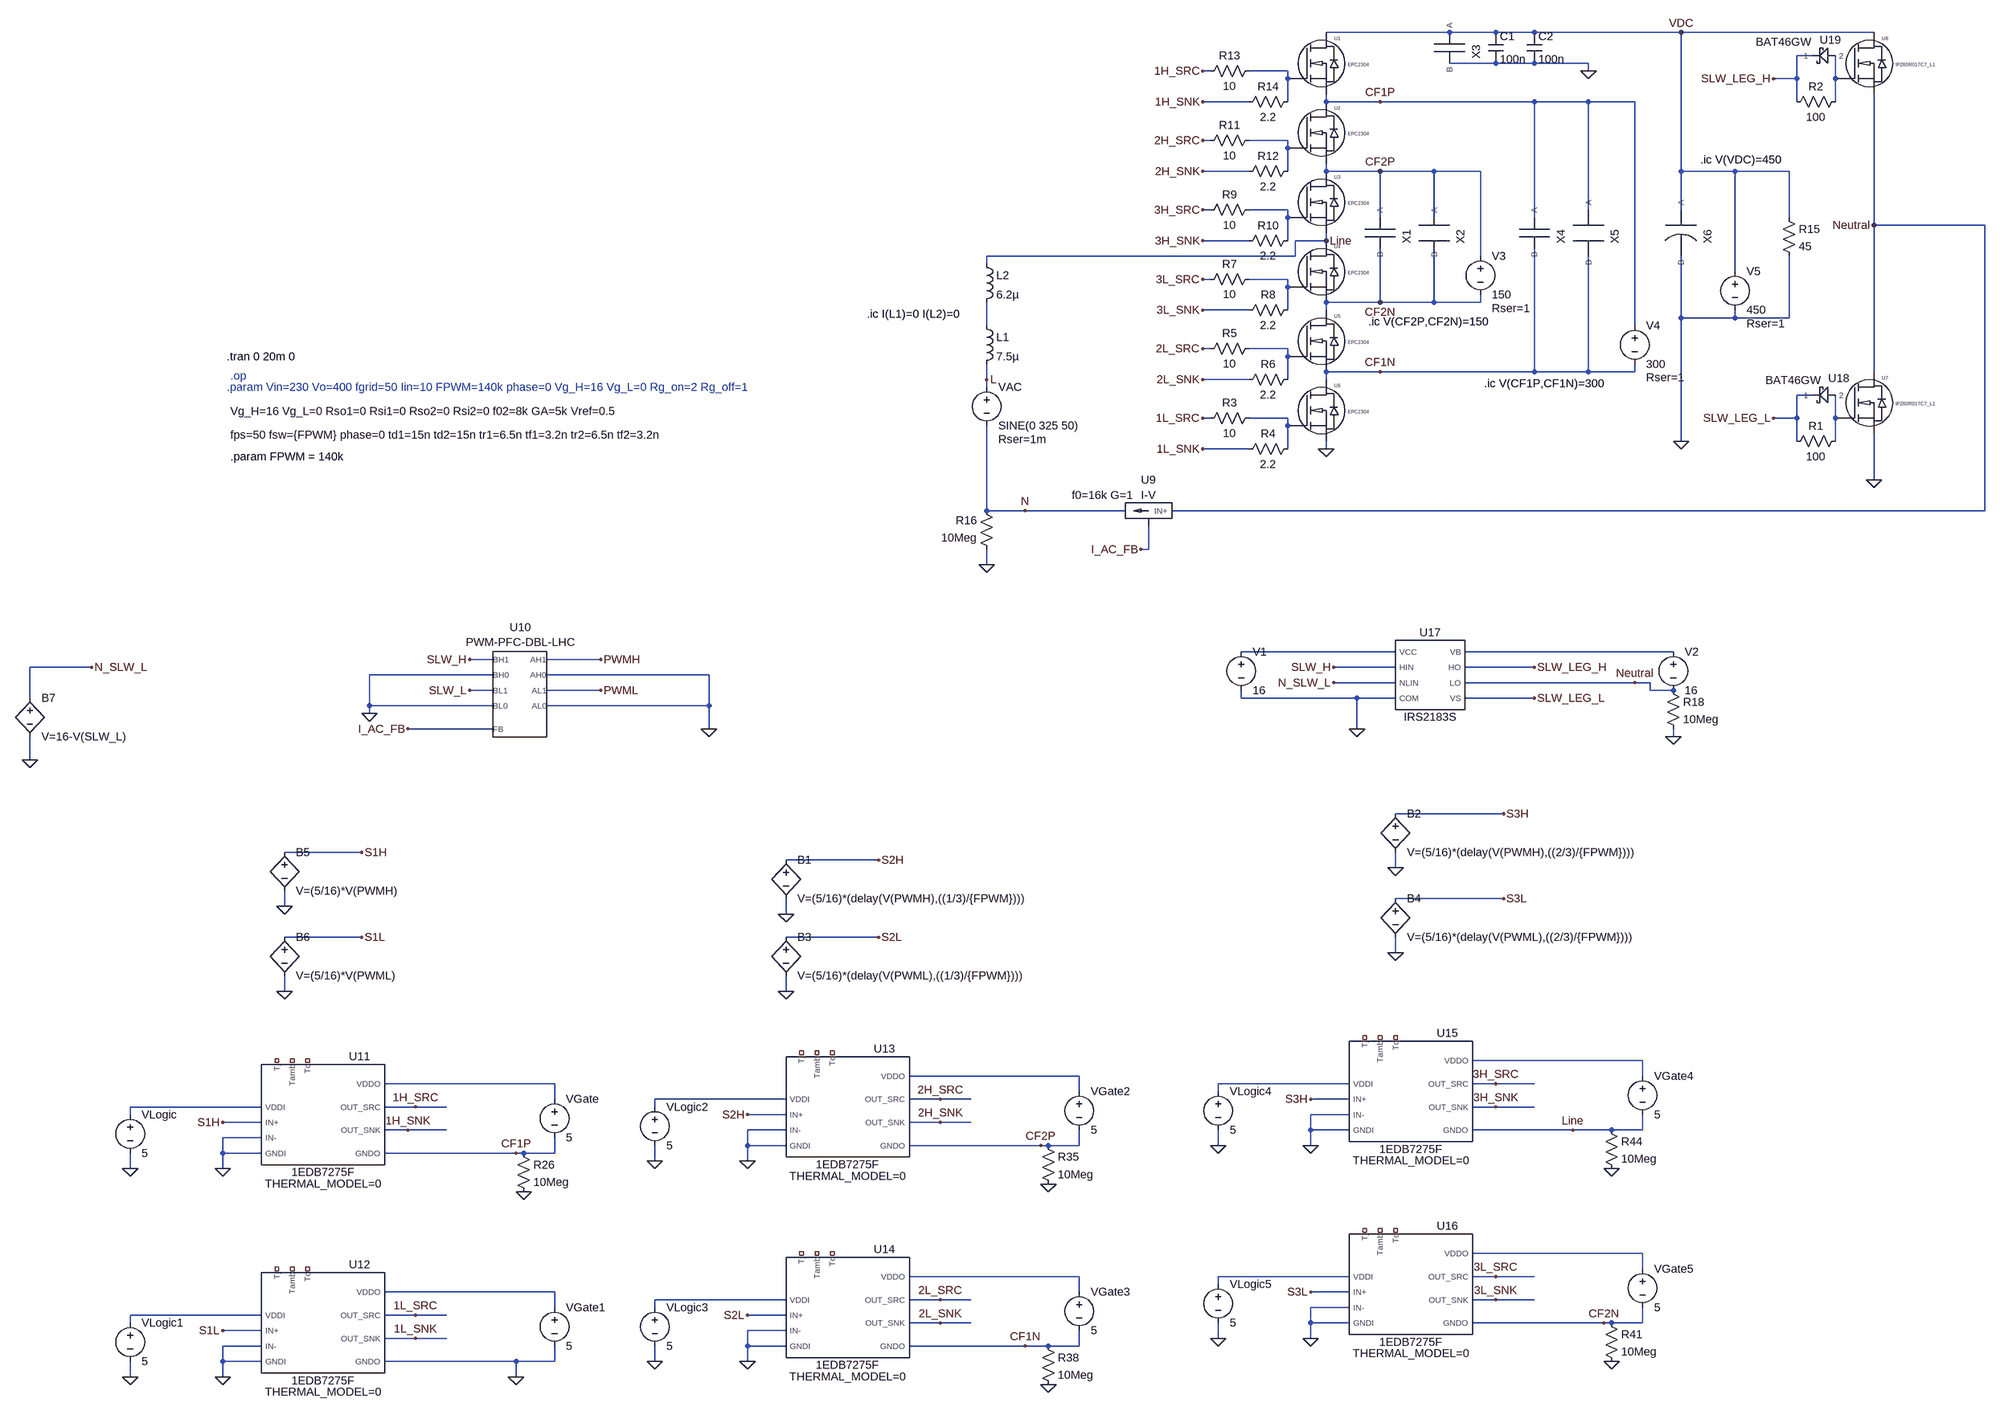
[diagram p0: schematic PFC.asc]
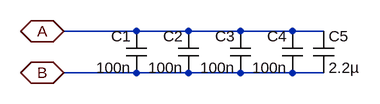
[diagram p1: sub-circuit hf_decoup.asc]
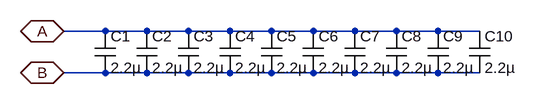
[diagram p2: sub-circuit fl2.asc]
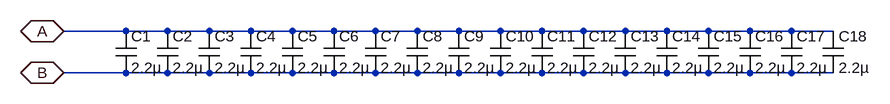
[diagram p3: sub-circuit fl1.asc]
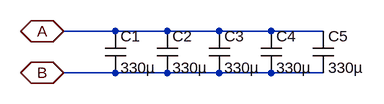
[diagram p4: sub-circuit bulk_cap.asc]
PFC.asc, the LTspice schematic file:
Version 4.1
SHEET 1 4276 2968
WIRE 352 0 96 0
WIRE 448 0 352 0
WIRE 528 0 448 0
WIRE 832 0 528 0
WIRE 1232 0 832 0
WIRE 1104 48 1072 48
WIRE 448 64 352 64
WIRE 528 64 448 64
WIRE 640 64 528 64
WIRE -144 80 -160 80
WIRE 16 80 -64 80
WIRE 640 80 640 64
WIRE 16 96 16 80
WIRE 1072 96 1072 48
WIRE 1072 96 1024 96
WIRE 1152 96 1152 48
WIRE -64 144 -160 144
WIRE 16 144 16 96
WIRE 96 144 96 128
WIRE 208 144 96 144
WIRE 528 144 208 144
WIRE 640 144 528 144
WIRE 736 144 640 144
WIRE 1072 144 1072 96
WIRE 1152 144 1152 96
WIRE -144 224 -160 224
WIRE 16 224 -64 224
WIRE 16 240 16 224
WIRE -64 288 -160 288
WIRE 16 288 16 240
WIRE 96 288 96 272
WIRE 208 288 96 288
WIRE 320 288 208 288
WIRE 416 288 320 288
WIRE 832 288 832 0
WIRE 944 288 832 288
WIRE 1056 288 944 288
WIRE -144 368 -160 368
WIRE 16 368 -64 368
WIRE 640 368 640 144
WIRE 832 368 832 288
WIRE 16 384 16 368
WIRE 208 384 208 288
WIRE 320 384 320 288
WIRE 528 384 528 144
WIRE 1056 384 1056 288
WIRE 1232 400 1232 128
WIRE 1792 400 1232 400
WIRE -64 432 -160 432
WIRE 16 432 16 384
WIRE 96 432 96 416
WIRE 96 432 32 432
WIRE 32 464 32 432
WIRE 32 464 -608 464
WIRE 416 464 416 288
WIRE -608 480 -608 464
WIRE 944 496 944 288
WIRE -144 512 -160 512
WIRE 16 512 -64 512
WIRE 16 528 16 512
WIRE 208 560 208 448
WIRE 208 560 96 560
WIRE 320 560 320 448
WIRE 320 560 208 560
WIRE 416 560 416 544
WIRE 416 560 320 560
WIRE -64 576 -160 576
WIRE 16 576 16 528
WIRE 96 576 96 560
WIRE 832 592 832 464
WIRE 944 592 944 576
WIRE 944 592 832 592
WIRE 1056 592 1056 464
WIRE 1056 592 944 592
WIRE -608 608 -608 560
WIRE 736 608 736 144
WIRE -144 656 -160 656
WIRE 16 656 -64 656
WIRE 16 672 16 656
WIRE 208 704 96 704
WIRE 528 704 528 448
WIRE 528 704 208 704
WIRE 640 704 640 464
WIRE 640 704 528 704
WIRE 736 704 736 688
WIRE 736 704 640 704
WIRE 1232 704 1232 400
WIRE -608 720 -608 688
WIRE -64 720 -160 720
WIRE 16 720 16 672
WIRE 96 720 96 704
WIRE -608 736 -608 720
WIRE 1104 752 1072 752
WIRE -144 800 -160 800
WIRE 16 800 -64 800
WIRE 1072 800 1072 752
WIRE 1072 800 1024 800
WIRE 1152 800 1152 752
WIRE 16 816 16 800
WIRE 832 848 832 592
WIRE 1072 848 1072 800
WIRE 1152 848 1152 800
WIRE -64 864 -160 864
WIRE 16 864 16 816
WIRE 96 864 96 848
WIRE 1232 928 1232 832
WIRE -608 992 -608 816
WIRE -528 992 -608 992
WIRE -320 992 -528 992
WIRE 1792 992 1792 400
WIRE 1792 992 -224 992
WIRE -272 1072 -272 1024
WIRE -272 1072 -288 1072
WIRE -608 1104 -608 1072
WIRE 240 1328 -80 1328
WIRE 816 1328 384 1328
WIRE -1632 1344 -1680 1344
WIRE -1408 1344 -1520 1344
WIRE -2464 1360 -2592 1360
WIRE 240 1360 112 1360
WIRE 528 1360 384 1360
WIRE -1632 1376 -1888 1376
WIRE -1184 1376 -1520 1376
WIRE 240 1392 112 1392
WIRE 736 1392 384 1392
WIRE 768 1392 736 1392
WIRE -1632 1408 -1680 1408
WIRE -1408 1408 -1520 1408
WIRE 768 1408 768 1392
WIRE 816 1408 768 1408
WIRE -2592 1424 -2592 1360
WIRE -80 1424 -80 1408
WIRE 160 1424 -80 1424
WIRE 240 1424 160 1424
WIRE 528 1424 384 1424
WIRE -1888 1440 -1888 1376
WIRE -1632 1440 -1888 1440
WIRE -1184 1440 -1184 1376
WIRE -1184 1440 -1520 1440
WIRE -1888 1456 -1888 1440
WIRE -1632 1488 -1808 1488
WIRE -1184 1488 -1184 1440
WIRE 160 1488 160 1424
WIRE 816 1504 816 1488
WIRE -2592 1552 -2592 1504
WIRE 464 1664 240 1664
WIRE -1904 1744 -2064 1744
WIRE -832 1760 -1024 1760
WIRE 240 1776 240 1744
WIRE 464 1840 240 1840
WIRE -2064 1856 -2064 1824
WIRE -1024 1872 -1024 1840
WIRE -1904 1920 -2064 1920
WIRE -832 1920 -1024 1920
WIRE 240 1952 240 1920
WIRE -2064 2032 -2064 2000
WIRE -1024 2032 -1024 2000
WIRE 752 2176 400 2176
WIRE -416 2208 -768 2208
WIRE 752 2208 752 2176
WIRE -1504 2224 -1856 2224
WIRE 144 2224 -128 2224
WIRE 448 2224 400 2224
WIRE 528 2224 448 2224
WIRE -416 2240 -416 2208
WIRE -128 2240 -128 2224
WIRE -1504 2256 -1504 2224
WIRE -1024 2256 -1296 2256
WIRE -704 2256 -768 2256
WIRE -640 2256 -704 2256
WIRE 144 2256 64 2256
WIRE -2112 2272 -2384 2272
WIRE -1792 2272 -1856 2272
WIRE -1728 2272 -1792 2272
WIRE -1296 2272 -1296 2256
WIRE 448 2272 400 2272
WIRE 528 2272 448 2272
WIRE -2384 2288 -2384 2272
WIRE -1024 2288 -1104 2288
WIRE 144 2288 64 2288
WIRE -2112 2304 -2192 2304
WIRE -704 2304 -768 2304
WIRE -640 2304 -704 2304
WIRE -1808 2320 -1856 2320
WIRE -1728 2320 -1808 2320
WIRE -1024 2320 -1104 2320
WIRE 64 2320 64 2288
WIRE 144 2320 64 2320
WIRE 608 2320 400 2320
WIRE 688 2320 608 2320
WIRE 752 2320 752 2288
WIRE 752 2320 688 2320
WIRE -2112 2336 -2192 2336
WIRE -1104 2352 -1104 2320
WIRE -1024 2352 -1104 2352
WIRE -496 2352 -768 2352
WIRE -480 2352 -496 2352
WIRE -416 2352 -416 2320
WIRE -416 2352 -480 2352
WIRE -128 2352 -128 2320
WIRE 64 2352 64 2320
WIRE -2192 2368 -2192 2336
WIRE -2112 2368 -2192 2368
WIRE -1584 2368 -1856 2368
WIRE -1568 2368 -1584 2368
WIRE -1504 2368 -1504 2336
WIRE -1504 2368 -1568 2368
WIRE -1296 2384 -1296 2352
WIRE -1104 2384 -1104 2352
WIRE -2384 2400 -2384 2368
WIRE -2192 2400 -2192 2368
WIRE 752 2576 400 2576
WIRE 752 2608 752 2576
WIRE -416 2624 -768 2624
WIRE 144 2624 -128 2624
WIRE 448 2624 400 2624
WIRE 528 2624 448 2624
WIRE -128 2640 -128 2624
WIRE -1504 2656 -1856 2656
WIRE -416 2656 -416 2624
WIRE 144 2656 64 2656
WIRE -1024 2672 -1296 2672
WIRE -704 2672 -768 2672
WIRE -640 2672 -704 2672
WIRE 448 2672 400 2672
WIRE 528 2672 448 2672
WIRE -1504 2688 -1504 2656
WIRE -1296 2688 -1296 2672
WIRE 144 2688 64 2688
WIRE -2112 2704 -2384 2704
WIRE -1792 2704 -1856 2704
WIRE -1728 2704 -1792 2704
WIRE -1024 2704 -1104 2704
WIRE -2384 2720 -2384 2704
WIRE -704 2720 -768 2720
WIRE -640 2720 -704 2720
WIRE 64 2720 64 2688
WIRE 144 2720 64 2720
WIRE 672 2720 400 2720
WIRE 688 2720 672 2720
WIRE 752 2720 752 2688
WIRE 752 2720 688 2720
WIRE -2112 2736 -2192 2736
WIRE -1024 2736 -1104 2736
WIRE -1792 2752 -1856 2752
WIRE -1728 2752 -1792 2752
WIRE -128 2752 -128 2720
WIRE 64 2752 64 2720
WIRE -2112 2768 -2192 2768
WIRE -1104 2768 -1104 2736
WIRE -1024 2768 -1104 2768
WIRE -528 2768 -768 2768
WIRE -480 2768 -528 2768
WIRE -416 2768 -416 2736
WIRE -416 2768 -480 2768
WIRE -2192 2800 -2192 2768
WIRE -2112 2800 -2192 2800
WIRE -1584 2800 -1856 2800
WIRE -1504 2800 -1504 2768
WIRE -1504 2800 -1584 2800
WIRE -1296 2800 -1296 2768
WIRE -1104 2800 -1104 2768
WIRE -2384 2832 -2384 2800
WIRE -2192 2832 -2192 2800
WIRE -1584 2832 -1584 2800
FLAG 96 864 0
FLAG 1232 928 0
FLAG 640 80 0
FLAG 832 848 0
FLAG -288 1072 I_AC_FB
FLAG -1808 1488 I_AC_FB
FLAG -1184 1488 0
FLAG 1024 800 SLW_LEG_L
FLAG 1024 96 SLW_LEG_H
FLAG 1232 400 Neutral
FLAG -1408 1344 PWMH
FLAG -1408 1408 PWML
FLAG 208 144 CF1P
FLAG 208 288 CF2P
FLAG 208 560 CF2N
FLAG 208 704 CF1N
FLAG -2064 1856 0
FLAG -2064 2032 0
FLAG -1024 1872 0
FLAG -1024 2032 0
FLAG 240 1776 0
FLAG 240 1952 0
FLAG -1904 1744 S1H
FLAG -1904 1920 S1L
FLAG -832 1760 S2H
FLAG -832 1920 S2L
FLAG 464 1664 S3H
FLAG 464 1840 S3L
FLAG -160 80 1H_SRC
FLAG -160 144 1H_SNK
FLAG -160 224 2H_SRC
FLAG -160 288 2H_SNK
FLAG -160 368 3H_SRC
FLAG -160 432 3H_SNK
FLAG -160 512 3L_SRC
FLAG -160 576 3L_SNK
FLAG -160 656 2L_SRC
FLAG -160 720 2L_SNK
FLAG -160 800 1L_SRC
FLAG -160 864 1L_SNK
FLAG -2384 2400 0
FLAG -2192 2400 0
FLAG -2192 2304 S1H
FLAG -1792 2272 1H_SRC
FLAG -1808 2320 1H_SNK
FLAG -1584 2368 CF1P
FLAG -2384 2832 0
FLAG -2192 2832 0
FLAG -2192 2736 S1L
FLAG -1792 2704 1L_SRC
FLAG -1792 2752 1L_SNK
FLAG -1584 2832 0
FLAG -1296 2384 0
FLAG -1104 2384 0
FLAG -1104 2288 S2H
FLAG -704 2256 2H_SRC
FLAG -704 2304 2H_SNK
FLAG -1296 2800 0
FLAG -1104 2800 0
FLAG -1104 2704 S2L
FLAG -704 2672 2L_SRC
FLAG -704 2720 2L_SNK
FLAG -528 2768 CF1N
FLAG -128 2352 0
FLAG 64 2352 0
FLAG 64 2256 S3H
FLAG 448 2224 3H_SRC
FLAG 448 2272 3H_SNK
FLAG 96 432 Line
FLAG -128 2752 0
FLAG 64 2752 0
FLAG 64 2656 S3L
FLAG 448 2624 3L_SRC
FLAG 448 2672 3L_SNK
FLAG 832 0 VDC
FLAG -1568 2448 0
FLAG -496 2352 CF2P
FLAG -480 2432 0
FLAG -480 2848 0
FLAG 672 2720 CF2N
FLAG 688 2800 0
FLAG 688 2400 0
FLAG 160 1488 0
FLAG 528 1424 SLW_LEG_L
FLAG 736 1392 Neutral
FLAG 528 1360 SLW_LEG_H
FLAG 816 1504 0
FLAG -1888 1456 0
FLAG -1680 1344 SLW_H
FLAG -1680 1408 SLW_L
FLAG 112 1360 SLW_H
FLAG 608 2320 Line
FLAG -2592 1552 0
FLAG -2464 1360 N_SLW_L
FLAG 112 1392 N_SLW_L
FLAG -608 720 L
FLAG -528 992 N
FLAG -608 1104 0
SYMBOL EPCGaN 16 96 R0
SYMATTR InstName U1
SYMBOL EPCGaN 16 240 R0
SYMATTR InstName U2
SYMBOL EPCGaN 16 384 R0
SYMATTR InstName U3
SYMBOL EPCGaN 16 528 R0
SYMATTR InstName U4
SYMBOL EPCGaN 16 672 R0
SYMATTR InstName U5
SYMBOL EPCGaN 16 816 R0
SYMATTR InstName U6
SYMBOL IPx6xx_L1 1152 800 R0
SYMATTR InstName U7
SYMBOL IPx6xx_L1 1152 96 R0
SYMATTR InstName U8
SYMBOL voltage -608 720 R0
WINDOW 123 0 0 Left 0
WINDOW 39 24 124 Left 2
SYMATTR SpiceLine Rser=1m
SYMATTR InstName VAC
SYMATTR Value SINE(0 325 50)
SYMBOL ind -624 592 R0
SYMATTR InstName L1
SYMATTR Value 7.5µ
SYMATTR SpiceLine Ipk=96 Rser=2.11m Rpar=3.209k Cpar=4p
SYMBOL HF_decoup 208 416 R90
SYMATTR InstName X1
SYMBOL FL2 320 416 R90
SYMATTR InstName X2
SYMBOL HF_decoup 352 32 R90
SYMATTR InstName X3
SYMBOL cap 432 0 R0
SYMATTR InstName C1
SYMATTR Value 100n
SYMATTR SpiceLine V=450 Rser=0.0242 Lser=0.75n Rpar=5Giga
SYMBOL cap 512 0 R0
SYMATTR InstName C2
SYMATTR Value 100n
SYMATTR SpiceLine V=450 Rser=0.0242 Lser=0.75n Rpar=5Giga
SYMBOL HF_decoup 528 416 R90
SYMATTR InstName X4
SYMBOL FL1 640 416 R90
SYMATTR InstName X5
SYMBOL Bulk_cap 832 416 R90
SYMATTR InstName X6
SYMBOL I-V -288 992 M0
SYMATTR InstName U9
SYMATTR SpiceLine f0=16k G=1
SYMBOL ind -624 464 R0
SYMATTR InstName L2
SYMATTR Value 6.2µ
SYMATTR SpiceLine Ipk=74 Rser=1.05m Rpar=1.5k Cpar=6.5p
SYMBOL PWM-PFC-DBL-LHC -1584 1472 R0
WINDOW 39 -592 -637 Left 2
WINDOW 40 -592 -686 Left 2
SYMATTR InstName U10
SYMATTR SpiceLine fps=50 fsw={FPWM} phase=0 td1=15n td2=15n tr1=6.5n tf1=3.2n tr2=6.5n tf2=3.2n
SYMATTR SpiceLine2 Vg_H=16 Vg_L=0 Rso1=0 Rsi1=0 Rso2=0 Rsi2=0 f02=8k GA=5k Vref=0.5
SYMBOL res 1168 832 R90
WINDOW 0 0 56 VBottom 2
WINDOW 3 32 56 VTop 2
SYMATTR InstName R1
SYMATTR Value 100
SYMBOL res 1168 128 R90
WINDOW 0 0 56 VBottom 2
WINDOW 3 32 56 VTop 2
SYMATTR InstName R2
SYMATTR Value 100
SYMBOL bv -1024 1744 R0
SYMATTR InstName B1
SYMATTR Value V=(5/16)*(delay(V(PWMH),((1/3)/{FPWM})))
SYMBOL res -48 784 R90
WINDOW 0 0 56 VBottom 2
WINDOW 3 32 56 VTop 2
SYMATTR InstName R3
SYMATTR Value 10
SYMBOL res 32 848 R90
WINDOW 0 0 56 VBottom 2
WINDOW 3 32 56 VTop 2
SYMATTR InstName R4
SYMATTR Value 2.2
SYMBOL res -48 640 R90
WINDOW 0 0 56 VBottom 2
WINDOW 3 32 56 VTop 2
SYMATTR InstName R5
SYMATTR Value 10
SYMBOL res 32 704 R90
WINDOW 0 0 56 VBottom 2
WINDOW 3 32 56 VTop 2
SYMATTR InstName R6
SYMATTR Value 2.2
SYMBOL res -48 496 R90
WINDOW 0 0 56 VBottom 2
WINDOW 3 32 56 VTop 2
SYMATTR InstName R7
SYMATTR Value 10
SYMBOL res 32 560 R90
WINDOW 0 0 56 VBottom 2
WINDOW 3 32 56 VTop 2
SYMATTR InstName R8
SYMATTR Value 2.2
SYMBOL res -48 352 R90
WINDOW 0 0 56 VBottom 2
WINDOW 3 32 56 VTop 2
SYMATTR InstName R9
SYMATTR Value 10
SYMBOL res 32 416 R90
WINDOW 0 0 56 VBottom 2
WINDOW 3 32 56 VTop 2
SYMATTR InstName R10
SYMATTR Value 2.2
SYMBOL res -48 208 R90
WINDOW 0 0 56 VBottom 2
WINDOW 3 32 56 VTop 2
SYMATTR InstName R11
SYMATTR Value 10
SYMBOL res 32 272 R90
WINDOW 0 0 56 VBottom 2
WINDOW 3 32 56 VTop 2
SYMATTR InstName R12
SYMATTR Value 2.2
SYMBOL res -48 64 R90
WINDOW 0 0 56 VBottom 2
WINDOW 3 32 56 VTop 2
SYMATTR InstName R13
SYMATTR Value 10
SYMBOL res 32 128 R90
WINDOW 0 0 56 VBottom 2
WINDOW 3 32 56 VTop 2
SYMATTR InstName R14
SYMATTR Value 2.2
SYMBOL bv -1024 1904 R0
SYMATTR InstName B3
SYMATTR Value V=(5/16)*(delay(V(PWML),((1/3)/{FPWM})))
SYMBOL bv 240 1648 R0
SYMATTR InstName B2
SYMATTR Value V=(5/16)*(delay(V(PWMH),((2/3)/{FPWM})))
SYMBOL bv 240 1824 R0
SYMATTR InstName B4
SYMATTR Value V=(5/16)*(delay(V(PWML),((2/3)/{FPWM})))
SYMBOL bv -2064 1728 R0
SYMATTR InstName B5
SYMATTR Value V=(5/16)*V(PWMH)
SYMBOL bv -2064 1904 R0
SYMATTR InstName B6
SYMATTR Value V=(5/16)*V(PWML)
SYMBOL 1EDB7275F -1984 2288 R0
SYMATTR InstName U11
SYMATTR SpiceLine THERMAL_MODEL=0
SYMBOL voltage -2384 2272 R0
WINDOW 123 0 0 Left 0
WINDOW 39 0 0 Left 0
SYMATTR InstName VLogic
SYMATTR Value 5
SYMBOL voltage -1504 2240 R0
WINDOW 123 0 0 Left 0
WINDOW 39 0 0 Left 0
SYMATTR InstName VGate
SYMATTR Value 5
SYMBOL 1EDB7275F -1984 2720 R0
SYMATTR InstName U12
SYMATTR SpiceLine THERMAL_MODEL=0
SYMBOL voltage -2384 2704 R0
WINDOW 123 0 0 Left 0
WINDOW 39 0 0 Left 0
SYMATTR InstName VLogic1
SYMATTR Value 5
SYMBOL voltage -1504 2672 R0
WINDOW 123 0 0 Left 0
WINDOW 39 0 0 Left 0
SYMATTR InstName VGate1
SYMATTR Value 5
SYMBOL 1EDB7275F -896 2272 R0
SYMATTR InstName U13
SYMATTR SpiceLine THERMAL_MODEL=0
SYMBOL voltage -1296 2256 R0
WINDOW 123 0 0 Left 0
WINDOW 39 0 0 Left 0
SYMATTR InstName VLogic2
SYMATTR Value 5
SYMBOL voltage -416 2224 R0
WINDOW 123 0 0 Left 0
WINDOW 39 0 0 Left 0
SYMATTR InstName VGate2
SYMATTR Value 5
SYMBOL 1EDB7275F -896 2688 R0
SYMATTR InstName U14
SYMATTR SpiceLine THERMAL_MODEL=0
SYMBOL voltage -1296 2672 R0
WINDOW 123 0 0 Left 0
WINDOW 39 0 0 Left 0
SYMATTR InstName VLogic3
SYMATTR Value 5
SYMBOL voltage -416 2640 R0
WINDOW 123 0 0 Left 0
WINDOW 39 0 0 Left 0
SYMATTR InstName VGate3
SYMATTR Value 5
SYMBOL 1EDB7275F 272 2240 R0
SYMATTR InstName U15
SYMATTR SpiceLine THERMAL_MODEL=0
SYMBOL voltage -128 2224 R0
WINDOW 123 0 0 Left 0
WINDOW 39 0 0 Left 0
SYMATTR InstName VLogic4
SYMATTR Value 5
SYMBOL voltage 752 2192 R0
WINDOW 123 0 0 Left 0
WINDOW 39 0 0 Left 0
SYMATTR InstName VGate4
SYMATTR Value 5
SYMBOL 1EDB7275F 272 2640 R0
SYMATTR InstName U16
SYMATTR SpiceLine THERMAL_MODEL=0
SYMBOL voltage -128 2624 R0
WINDOW 123 0 0 Left 0
WINDOW 39 0 0 Left 0
SYMATTR InstName VLogic5
SYMATTR Value 5
SYMBOL voltage 752 2592 R0
WINDOW 123 0 0 Left 0
WINDOW 39 0 0 Left 0
SYMATTR InstName VGate5
SYMATTR Value 5
SYMBOL res 1040 368 R0
SYMATTR InstName R15
SYMATTR Value 45
SYMBOL res -1584 2352 R0
SYMATTR InstName R26
SYMATTR Value 10Meg
SYMBOL res -496 2336 R0
SYMATTR InstName R35
SYMATTR Value 10Meg
SYMBOL res -496 2752 R0
SYMATTR InstName R38
SYMATTR Value 10Meg
SYMBOL res 672 2704 R0
SYMATTR InstName R41
SYMATTR Value 10Meg
SYMBOL res 672 2304 R0
SYMATTR InstName R44
SYMATTR Value 10Meg
SYMBOL IRS2183S 304 1376 R0
SYMATTR InstName U17
SYMBOL voltage -80 1312 R0
WINDOW 123 0 0 Left 0
WINDOW 39 0 0 Left 0
SYMATTR InstName V1
SYMATTR Value 16
SYMBOL voltage 816 1312 R0
WINDOW 123 0 0 Left 0
WINDOW 39 0 0 Left 0
SYMATTR InstName V2
SYMATTR Value 16
SYMBOL res 800 1392 R0
SYMATTR InstName R18
SYMATTR Value 10Meg
SYMBOL bv -2592 1408 R0
SYMATTR InstName B7
SYMATTR Value V=16-V(SLW_L)
SYMBOL voltage 416 448 R0
WINDOW 123 0 0 Left 0
WINDOW 39 24 124 Left 2
SYMATTR SpiceLine Rser=1
SYMATTR InstName V3
SYMATTR Value 150
SYMBOL voltage 736 592 R0
WINDOW 123 0 0 Left 0
WINDOW 39 24 124 Left 2
SYMATTR SpiceLine Rser=1
SYMATTR InstName V4
SYMATTR Value 300
SYMBOL voltage 944 480 R0
WINDOW 123 0 0 Left 0
WINDOW 39 24 124 Left 2
SYMATTR SpiceLine Rser=1
SYMATTR InstName V5
SYMATTR Value 450
SYMBOL BAT46GW 1136 752 R0
WINDOW 0 23 -19 Bottom 2
WINDOW 3 -71 -46 Top 2
SYMATTR InstName U18
SYMBOL BAT46GW 1136 48 R0
WINDOW 0 6 -17 Bottom 2
WINDOW 3 -91 -44 Top 2
SYMATTR InstName U19
SYMBOL res -592 1088 R180
WINDOW 0 36 76 Left 2
WINDOW 3 36 40 Left 2
SYMATTR InstName R16
SYMATTR Value 10Meg
TEXT -2184 672 Left 2 !.tran 0 20m 0
TEXT 184 600 Left 2 !.ic V(CF2P,CF2N)=150
TEXT 424 728 Left 2 !.ic V(CF1P,CF1N)=300
TEXT 872 264 Left 2 !.ic V(VDC)=450
TEXT -856 584 Left 2 !.ic I(L1)=0 I(L2)=0
TEXT -2176 712 Left 2 ;.op
TEXT -2184 736 Left 2 ;.param Vin=230 Vo=400 fgrid=50 Iin=10 FPWM=140k phase=0 Vg_H=16 Vg_L=0 Rg_on=2 Rg_off=1
TEXT -2176 880 Left 2 !.param FPWM = 140k

hf_decoup.asc, the sub-circuit schematic file:
Version 4.1
SHEET 1 880 680
WIRE 192 96 80 96
WIRE 272 96 192 96
WIRE 352 96 272 96
WIRE 432 96 352 96
WIRE 480 96 432 96
WIRE 192 160 80 160
WIRE 272 160 192 160
WIRE 352 160 272 160
WIRE 432 160 352 160
WIRE 480 160 432 160
FLAG 80 96 A
IOPIN 80 96 BiDir
FLAG 80 160 B
IOPIN 80 160 BiDir
SYMBOL cap 208 160 R180
WINDOW 0 24 56 Left 2
WINDOW 3 24 8 Left 2
SYMATTR InstName C1
SYMATTR Value 100n
SYMATTR SpiceLine V=450 Rser=0.0242 Lser=0.75n Rpar=5G
SYMBOL cap 288 160 R180
WINDOW 0 24 56 Left 2
WINDOW 3 24 8 Left 2
SYMATTR InstName C2
SYMATTR Value 100n
SYMATTR SpiceLine V=450 Rser=0.0242 Lser=0.75n Rpar=5G
SYMBOL cap 368 160 R180
WINDOW 0 24 56 Left 2
WINDOW 3 24 8 Left 2
SYMATTR InstName C3
SYMATTR Value 100n
SYMATTR SpiceLine V=450 Rser=0.0242 Lser=0.75n Rpar=5G
SYMBOL cap 448 160 R180
WINDOW 0 24 56 Left 2
WINDOW 3 24 8 Left 2
SYMATTR InstName C4
SYMATTR Value 100n
SYMATTR SpiceLine V=450 Rser=0.0242 Lser=0.75n Rpar=5G
SYMBOL cap 464 96 R0
SYMATTR InstName C5
SYMATTR Value 2.2µ
SYMATTR SpiceLine V=450 Rser=0.0043 Lser=0.65n Rpar=0.227G

fl2.asc, the sub-circuit schematic file:
Version 4.1
SHEET 1 880 680
WIRE 128 96 64 96
WIRE 192 96 128 96
WIRE 256 96 192 96
WIRE 320 96 256 96
WIRE 384 96 320 96
WIRE 448 96 384 96
WIRE 512 96 448 96
WIRE 576 96 512 96
WIRE 640 96 576 96
WIRE 704 96 640 96
WIRE 128 160 64 160
WIRE 192 160 128 160
WIRE 256 160 192 160
WIRE 320 160 256 160
WIRE 384 160 320 160
WIRE 448 160 384 160
WIRE 512 160 448 160
WIRE 576 160 512 160
WIRE 640 160 576 160
WIRE 704 160 640 160
FLAG 64 96 A
IOPIN 64 96 BiDir
FLAG 64 160 B
IOPIN 64 160 BiDir
SYMBOL cap 112 96 R0
SYMATTR InstName C1
SYMATTR Value 2.2µ
SYMATTR SpiceLine V=450 Rser=0.0043 Lser=0.65n Rpar=0.227G
SYMBOL cap 176 96 R0
SYMATTR InstName C2
SYMATTR Value 2.2µ
SYMATTR SpiceLine V=450 Rser=0.0043 Lser=0.65n Rpar=0.227G
SYMBOL cap 240 96 R0
SYMATTR InstName C3
SYMATTR Value 2.2µ
SYMATTR SpiceLine V=450 Rser=0.0043 Lser=0.65n Rpar=0.227G
SYMBOL cap 304 96 R0
SYMATTR InstName C4
SYMATTR Value 2.2µ
SYMATTR SpiceLine V=450 Rser=0.0043 Lser=0.65n Rpar=0.227G
SYMBOL cap 368 96 R0
SYMATTR InstName C5
SYMATTR Value 2.2µ
SYMATTR SpiceLine V=450 Rser=0.0043 Lser=0.65n Rpar=0.227G
SYMBOL cap 432 96 R0
SYMATTR InstName C6
SYMATTR Value 2.2µ
SYMATTR SpiceLine V=450 Rser=0.0043 Lser=0.65n Rpar=0.227G
SYMBOL cap 496 96 R0
SYMATTR InstName C7
SYMATTR Value 2.2µ
SYMATTR SpiceLine V=450 Rser=0.0043 Lser=0.65n Rpar=0.227G
SYMBOL cap 560 96 R0
SYMATTR InstName C8
SYMATTR Value 2.2µ
SYMATTR SpiceLine V=450 Rser=0.0043 Lser=0.65n Rpar=0.227G
SYMBOL cap 624 96 R0
SYMATTR InstName C9
SYMATTR Value 2.2µ
SYMATTR SpiceLine V=450 Rser=0.0043 Lser=0.65n Rpar=0.227G
SYMBOL cap 688 96 R0
SYMATTR InstName C10
SYMATTR Value 2.2µ
SYMATTR SpiceLine V=450 Rser=0.0043 Lser=0.65n Rpar=0.227G

fl1.asc, the sub-circuit schematic file:
Version 4.1
SHEET 1 1280 680
WIRE 128 112 32 112
WIRE 192 112 128 112
WIRE 256 112 192 112
WIRE 320 112 256 112
WIRE 384 112 320 112
WIRE 448 112 384 112
WIRE 512 112 448 112
WIRE 576 112 512 112
WIRE 640 112 576 112
WIRE 704 112 640 112
WIRE 768 112 704 112
WIRE 832 112 768 112
WIRE 896 112 832 112
WIRE 960 112 896 112
WIRE 1024 112 960 112
WIRE 1088 112 1024 112
WIRE 1152 112 1088 112
WIRE 1216 112 1152 112
WIRE 128 176 32 176
WIRE 192 176 128 176
WIRE 256 176 192 176
WIRE 320 176 256 176
WIRE 384 176 320 176
WIRE 448 176 384 176
WIRE 512 176 448 176
WIRE 576 176 512 176
WIRE 640 176 576 176
WIRE 704 176 640 176
WIRE 768 176 704 176
WIRE 832 176 768 176
WIRE 896 176 832 176
WIRE 960 176 896 176
WIRE 1024 176 960 176
WIRE 1088 176 1024 176
WIRE 1152 176 1088 176
WIRE 1216 176 1152 176
FLAG 32 112 A
IOPIN 32 112 BiDir
FLAG 32 176 B
IOPIN 32 176 BiDir
SYMBOL cap 112 112 R0
SYMATTR InstName C1
SYMATTR Value 2.2µ
SYMATTR SpiceLine V=450 Rser=0.0043 Lser=0.65n Rpar=0.227G
SYMBOL cap 176 112 R0
SYMATTR InstName C2
SYMATTR Value 2.2µ
SYMATTR SpiceLine V=450 Rser=0.0043 Lser=0.65n Rpar=0.227G
SYMBOL cap 240 112 R0
SYMATTR InstName C3
SYMATTR Value 2.2µ
SYMATTR SpiceLine V=450 Rser=0.0043 Lser=0.65n Rpar=0.227G
SYMBOL cap 304 112 R0
SYMATTR InstName C4
SYMATTR Value 2.2µ
SYMATTR SpiceLine V=450 Rser=0.0043 Lser=0.65n Rpar=0.227G
SYMBOL cap 368 112 R0
SYMATTR InstName C5
SYMATTR Value 2.2µ
SYMATTR SpiceLine V=450 Rser=0.0043 Lser=0.65n Rpar=0.227G
SYMBOL cap 432 112 R0
SYMATTR InstName C6
SYMATTR Value 2.2µ
SYMATTR SpiceLine V=450 Rser=0.0043 Lser=0.65n Rpar=0.227G
SYMBOL cap 496 112 R0
SYMATTR InstName C7
SYMATTR Value 2.2µ
SYMATTR SpiceLine V=450 Rser=0.0043 Lser=0.65n Rpar=0.227G
SYMBOL cap 560 112 R0
SYMATTR InstName C8
SYMATTR Value 2.2µ
SYMATTR SpiceLine V=450 Rser=0.0043 Lser=0.65n Rpar=0.227G
SYMBOL cap 624 112 R0
SYMATTR InstName C9
SYMATTR Value 2.2µ
SYMATTR SpiceLine V=450 Rser=0.0043 Lser=0.65n Rpar=0.227G
SYMBOL cap 688 112 R0
SYMATTR InstName C10
SYMATTR Value 2.2µ
SYMATTR SpiceLine V=450 Rser=0.0043 Lser=0.65n Rpar=0.227G
SYMBOL cap 752 112 R0
SYMATTR InstName C11
SYMATTR Value 2.2µ
SYMATTR SpiceLine V=450 Rser=0.0043 Lser=0.65n Rpar=0.227G
SYMBOL cap 816 112 R0
SYMATTR InstName C12
SYMATTR Value 2.2µ
SYMATTR SpiceLine V=450 Rser=0.0043 Lser=0.65n Rpar=0.227G
SYMBOL cap 880 112 R0
SYMATTR InstName C13
SYMATTR Value 2.2µ
SYMATTR SpiceLine V=450 Rser=0.0043 Lser=0.65n Rpar=0.227G
SYMBOL cap 944 112 R0
SYMATTR InstName C14
SYMATTR Value 2.2µ
SYMATTR SpiceLine V=450 Rser=0.0043 Lser=0.65n Rpar=0.227G
SYMBOL cap 1008 112 R0
SYMATTR InstName C15
SYMATTR Value 2.2µ
SYMATTR SpiceLine V=450 Rser=0.0043 Lser=0.65n Rpar=0.227G
SYMBOL cap 1072 112 R0
SYMATTR InstName C16
SYMATTR Value 2.2µ
SYMATTR SpiceLine V=450 Rser=0.0043 Lser=0.65n Rpar=0.227G
SYMBOL cap 1136 112 R0
SYMATTR InstName C17
SYMATTR Value 2.2µ
SYMATTR SpiceLine V=450 Rser=0.0043 Lser=0.65n Rpar=0.227G
SYMBOL cap 1200 112 R0
SYMATTR InstName C18
SYMATTR Value 2.2µ
SYMATTR SpiceLine V=450 Rser=0.0043 Lser=0.65n Rpar=0.227G

bulk_cap.asc, the sub-circuit schematic file:
Version 4.1
SHEET 1 880 680
WIRE 144 128 64 128
WIRE 224 128 144 128
WIRE 304 128 224 128
WIRE 384 128 304 128
WIRE 464 128 384 128
WIRE 144 192 64 192
WIRE 224 192 144 192
WIRE 304 192 224 192
WIRE 384 192 304 192
WIRE 464 192 384 192
FLAG 64 128 A
IOPIN 64 128 BiDir
FLAG 64 192 B
IOPIN 64 192 BiDir
SYMBOL cap 128 128 R0
SYMATTR InstName C1
SYMATTR Value 330µ
SYMATTR SpiceLine V=450 Rser=0.3m Lser=25n Rpar=1Meg
SYMBOL cap 208 128 R0
SYMATTR InstName C2
SYMATTR Value 330µ
SYMATTR SpiceLine V=450 Rser=0.3m Lser=25n Rpar=1Meg
SYMBOL cap 288 128 R0
SYMATTR InstName C3
SYMATTR Value 330µ
SYMATTR SpiceLine V=450 Rser=0.3m Lser=25n Rpar=1Meg
SYMBOL cap 368 128 R0
SYMATTR InstName C4
SYMATTR Value 330µ
SYMATTR SpiceLine V=450 Rser=0.3m Lser=25n Rpar=1Meg
SYMBOL cap 448 128 R0
SYMATTR InstName C5
SYMATTR Value 330µ
SYMATTR SpiceLine V=450 Rser=0.3m Lser=25n Rpar=1Meg

The netlist it stands for:
* PFC.asc
X§U1 N001 VDC CF1P EPC2304  ; pins gatein drainin sourcein
X§U2 N003 CF1P CF2P EPC2304  ; pins gatein drainin sourcein
X§U3 N004 CF2P Line EPC2304  ; pins gatein drainin sourcein
X§U4 N005 Line CF2N EPC2304  ; pins gatein drainin sourcein
X§U5 N007 CF2N CF1N EPC2304  ; pins gatein drainin sourcein
X§U6 N008 CF1N 0 EPC2304  ; pins gatein drainin sourcein
X§U7 Neutral N009 0 IPZ60R017C7_L1  ; pins drain gate source
X§U8 VDC N002 Neutral IPZ60R017C7_L1  ; pins drain gate source
VAC L N SINE(0 325 50) Rser=1m
L1 N006 L 7.5µ Ipk=96 Rser=2.11m Rpar=3.209k Cpar=4p
X§X1 CF2P CF2N hf_decoup
X§X2 CF2P CF2N fl2
X§X3 VDC 0 hf_decoup
C1 VDC 0 100n V=450 Rser=0.0242 Lser=0.75n Rpar=5Giga
C2 VDC 0 100n V=450 Rser=0.0242 Lser=0.75n Rpar=5Giga
X§X4 CF1P CF1N hf_decoup
X§X5 CF1P CF1N fl1
X§X6 VDC 0 bulk_cap
X§U9 Neutral N I_AC_FB I-V f0=16k G=1  ; pins IN+ IN- OUT
L2 Line N006 6.2µ Ipk=74 Rser=1.05m Rpar=1.5k Cpar=6.5p
X§U10 PWMH 0 PWML 0 SLW_H 0 SLW_L 0 I_AC_FB PWM-PFC-DBL-LHC fps=50 fsw={FPWM} phase=0 td1=15n td2=15n tr1=6.5n tf1=3.2n tr2=6.5n tf2=3.2n Vg_H=16 Vg_L=0 Rso1=0 Rsi1=0 Rso2=0 Rsi2=0 f02=8k GA=5k Vref=0.5  ; pins AH1 AH0 AL1 AL0 BH1 BH0 BL1 BL0 FB
R1 N009 SLW_LEG_L 100
R2 N002 SLW_LEG_H 100
B1 S2H 0 V=(5/16)*(delay(V(PWMH),((1/3)/{FPWM})))
R3 N008 1L_SRC 10
R4 N008 1L_SNK 2.2
R5 N007 2L_SRC 10
R6 N007 2L_SNK 2.2
R7 N005 3L_SRC 10
R8 N005 3L_SNK 2.2
R9 N004 3H_SRC 10
R10 N004 3H_SNK 2.2
R11 N003 2H_SRC 10
R12 N003 2H_SNK 2.2
R13 N001 1H_SRC 10
R14 N001 1H_SNK 2.2
B3 S2L 0 V=(5/16)*(delay(V(PWML),((1/3)/{FPWM})))
B2 S3H 0 V=(5/16)*(delay(V(PWMH),((2/3)/{FPWM})))
B4 S3L 0 V=(5/16)*(delay(V(PWML),((2/3)/{FPWM})))
B5 S1H 0 V=(5/16)*V(PWMH)
B6 S1L 0 V=(5/16)*V(PWML)
X§U11 1H_SRC N014 S1H 0 N017 NC_01 NC_02 NC_03 0 1H_SNK CF1P 1EDB7275F THERMAL_MODEL=0  ; pins OUT_SRC VDDO IN+ GNDI VDDI Tj Tamb Tc IN- OUT_SNK GNDO
VLogic N017 0 5
VGate N014 CF1P 5
X§U12 1L_SRC N021 S1L 0 N023 NC_04 NC_05 NC_06 0 1L_SNK 0 1EDB7275F THERMAL_MODEL=0  ; pins OUT_SRC VDDO IN+ GNDI VDDI Tj Tamb Tc IN- OUT_SNK GNDO
VLogic1 N023 0 5
VGate1 N021 0 5
X§U13 2H_SRC N013 S2H 0 N016 NC_07 NC_08 NC_09 0 2H_SNK CF2P 1EDB7275F THERMAL_MODEL=0  ; pins OUT_SRC VDDO IN+ GNDI VDDI Tj Tamb Tc IN- OUT_SNK GNDO
VLogic2 N016 0 5
VGate2 N013 CF2P 5
X§U14 2L_SRC N019 S2L 0 N022 NC_10 NC_11 NC_12 0 2L_SNK CF1N 1EDB7275F THERMAL_MODEL=0  ; pins OUT_SRC VDDO IN+ GNDI VDDI Tj Tamb Tc IN- OUT_SNK GNDO
VLogic3 N022 0 5
VGate3 N019 CF1N 5
X§U15 3H_SRC N012 S3H 0 N015 NC_13 NC_14 NC_15 0 3H_SNK Line 1EDB7275F THERMAL_MODEL=0  ; pins OUT_SRC VDDO IN+ GNDI VDDI Tj Tamb Tc IN- OUT_SNK GNDO
VLogic4 N015 0 5
VGate4 N012 Line 5
X§U16 3L_SRC N018 S3L 0 N020 NC_16 NC_17 NC_18 0 3L_SNK CF2N 1EDB7275F THERMAL_MODEL=0  ; pins OUT_SRC VDDO IN+ GNDI VDDI Tj Tamb Tc IN- OUT_SNK GNDO
VLogic5 N020 0 5
VGate5 N018 CF2N 5
R15 VDC 0 45
R26 CF1P 0 10Meg
R35 CF2P 0 10Meg
R38 CF1N 0 10Meg
R41 CF2N 0 10Meg
R44 Line 0 10Meg
X§U17 Neutral SLW_LEG_H 0 SLW_H N_SLW_L N010 N011 SLW_LEG_L IRS2183S  ; pins LO HO COM HIN NLIN VCC VB VS
V1 N010 0 16
V2 N011 Neutral 16
R18 Neutral 0 10Meg
B7 N_SLW_L 0 V=16-V(SLW_L)
V3 CF2P CF2N 150 Rser=1
V4 CF1P CF1N 300 Rser=1
V5 VDC 0 450 Rser=1
X§U18 SLW_LEG_L N009 BAT46GW  ; pins 1 2
X§U19 SLW_LEG_H N002 BAT46GW  ; pins 1 2
R16 0 N 10Meg

* block symbol definitions
.subckt hf_decoup A B
C1 B A 100n V=450 Rser=0.0242 Lser=0.75n Rpar=5G
C2 B A 100n V=450 Rser=0.0242 Lser=0.75n Rpar=5G
C3 B A 100n V=450 Rser=0.0242 Lser=0.75n Rpar=5G
C4 B A 100n V=450 Rser=0.0242 Lser=0.75n Rpar=5G
C5 A B 2.2µ V=450 Rser=0.0043 Lser=0.65n Rpar=0.227G
.ends hf_decoup

.subckt fl2 A B
C1 A B 2.2µ V=450 Rser=0.0043 Lser=0.65n Rpar=0.227G
C2 A B 2.2µ V=450 Rser=0.0043 Lser=0.65n Rpar=0.227G
C3 A B 2.2µ V=450 Rser=0.0043 Lser=0.65n Rpar=0.227G
C4 A B 2.2µ V=450 Rser=0.0043 Lser=0.65n Rpar=0.227G
C5 A B 2.2µ V=450 Rser=0.0043 Lser=0.65n Rpar=0.227G
C6 A B 2.2µ V=450 Rser=0.0043 Lser=0.65n Rpar=0.227G
C7 A B 2.2µ V=450 Rser=0.0043 Lser=0.65n Rpar=0.227G
C8 A B 2.2µ V=450 Rser=0.0043 Lser=0.65n Rpar=0.227G
C9 A B 2.2µ V=450 Rser=0.0043 Lser=0.65n Rpar=0.227G
C10 A B 2.2µ V=450 Rser=0.0043 Lser=0.65n Rpar=0.227G
.ends fl2

.subckt fl1 A B
C1 A B 2.2µ V=450 Rser=0.0043 Lser=0.65n Rpar=0.227G
C2 A B 2.2µ V=450 Rser=0.0043 Lser=0.65n Rpar=0.227G
C3 A B 2.2µ V=450 Rser=0.0043 Lser=0.65n Rpar=0.227G
C4 A B 2.2µ V=450 Rser=0.0043 Lser=0.65n Rpar=0.227G
C5 A B 2.2µ V=450 Rser=0.0043 Lser=0.65n Rpar=0.227G
C6 A B 2.2µ V=450 Rser=0.0043 Lser=0.65n Rpar=0.227G
C7 A B 2.2µ V=450 Rser=0.0043 Lser=0.65n Rpar=0.227G
C8 A B 2.2µ V=450 Rser=0.0043 Lser=0.65n Rpar=0.227G
C9 A B 2.2µ V=450 Rser=0.0043 Lser=0.65n Rpar=0.227G
C10 A B 2.2µ V=450 Rser=0.0043 Lser=0.65n Rpar=0.227G
C11 A B 2.2µ V=450 Rser=0.0043 Lser=0.65n Rpar=0.227G
C12 A B 2.2µ V=450 Rser=0.0043 Lser=0.65n Rpar=0.227G
C13 A B 2.2µ V=450 Rser=0.0043 Lser=0.65n Rpar=0.227G
C14 A B 2.2µ V=450 Rser=0.0043 Lser=0.65n Rpar=0.227G
C15 A B 2.2µ V=450 Rser=0.0043 Lser=0.65n Rpar=0.227G
C16 A B 2.2µ V=450 Rser=0.0043 Lser=0.65n Rpar=0.227G
C17 A B 2.2µ V=450 Rser=0.0043 Lser=0.65n Rpar=0.227G
C18 A B 2.2µ V=450 Rser=0.0043 Lser=0.65n Rpar=0.227G
.ends fl1

.subckt bulk_cap A B
C1 A B 330µ V=450 Rser=0.3m Lser=25n Rpar=1Meg
C2 A B 330µ V=450 Rser=0.3m Lser=25n Rpar=1Meg
C3 A B 330µ V=450 Rser=0.3m Lser=25n Rpar=1Meg
C4 A B 330µ V=450 Rser=0.3m Lser=25n Rpar=1Meg
C5 A B 330µ V=450 Rser=0.3m Lser=25n Rpar=1Meg
.ends bulk_cap

.tran 0 20m 0
.ic V(CF2P,CF2N)=150
.ic V(CF1P,CF1N)=300
.ic V(VDC)=450
.ic I(L1)=0 I(L2)=0
* .op
* .param Vin=230 Vo=400 fgrid=50 Iin=10 FPWM=140k phase=0 Vg_H=16 Vg_L=0 Rg_on=2 Rg_off=1
.param FPWM = 140k
.lib EPCGanlibrary.lib
.lib Infineon_SimulationModel_CoolMOS_C7_MOSFET_600V_Spice.lib
.lib SS I-V.lib
.lib SS PWM-PFC-DBL-LHC.lib
.lib 1EDB7275F.lib
.lib IRS2183S.lib
.lib BAT46GW.lib
.backanno
.end